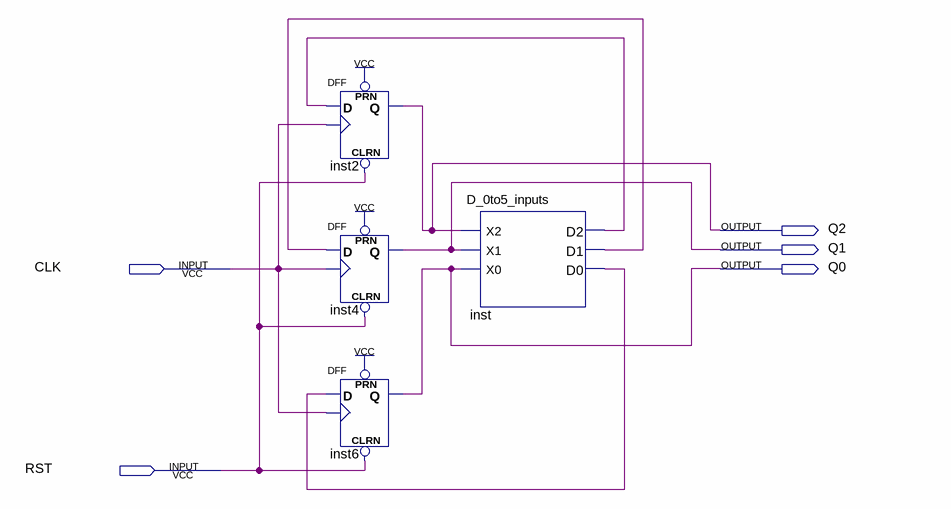
[diagram p0: schematic sheet]
// Quartus schematic 0to5_up_counter.bdf as structural Verilog: 4 symbols, 5 pins
module \0to5_up_counter  (
  input  CLK,
  input  RST,
  output Q2,
  output Q1,
  output Q0
);

  wire inst_d0, inst_d1, inst_d2;

  DFF inst2 (.CLRN(RST), .CLK(CLK), .D(inst_d2), .PRN(1'b1), .Q(Q2));
  DFF inst4 (.CLRN(RST), .CLK(CLK), .D(inst_d1), .PRN(1'b1), .Q(Q1));
  DFF inst6 (.CLRN(RST), .CLK(CLK), .D(inst_d0), .PRN(1'b1), .Q(Q0));
  D_0to5_inputs inst (.X2(Q2), .X1(Q1), .X0(Q0), .D2(inst_d2), .D1(inst_d1), .D0(inst_d0));
endmodule
